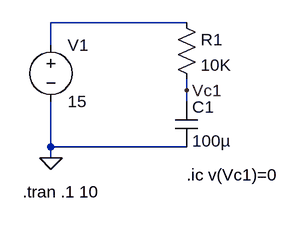
[diagram p0: schematic transient analysis of charging.asc]
transient analysis of charging.asc, the LTspice schematic file:
Version 4
SHEET 1 880 680
WIRE 304 80 112 80
WIRE 112 112 112 80
WIRE 304 176 304 160
WIRE 304 192 304 176
WIRE 112 256 112 192
WIRE 304 256 112 256
WIRE 112 272 112 256
FLAG 112 272 0
FLAG 304 176 Vc1
SYMBOL voltage 112 96 R0
SYMATTR InstName V1
SYMATTR Value 15
SYMBOL res 288 64 R0
SYMATTR InstName R1
SYMATTR Value 10K
SYMBOL cap 288 192 R0
SYMATTR InstName C1
SYMATTR Value 100µ
TEXT 304 296 Left 2 !.ic v(Vc1)=0
TEXT 72 320 Left 2 !.tran .1 10

The netlist it stands for:
* transient analysis of charging.asc
V1 N001 0 15
R1 N001 Vc1 10K
C1 Vc1 0 100µ
.ic v(Vc1)=0
.tran .1 10
.backanno
.end